# Altium project bop_it.PrjPcb
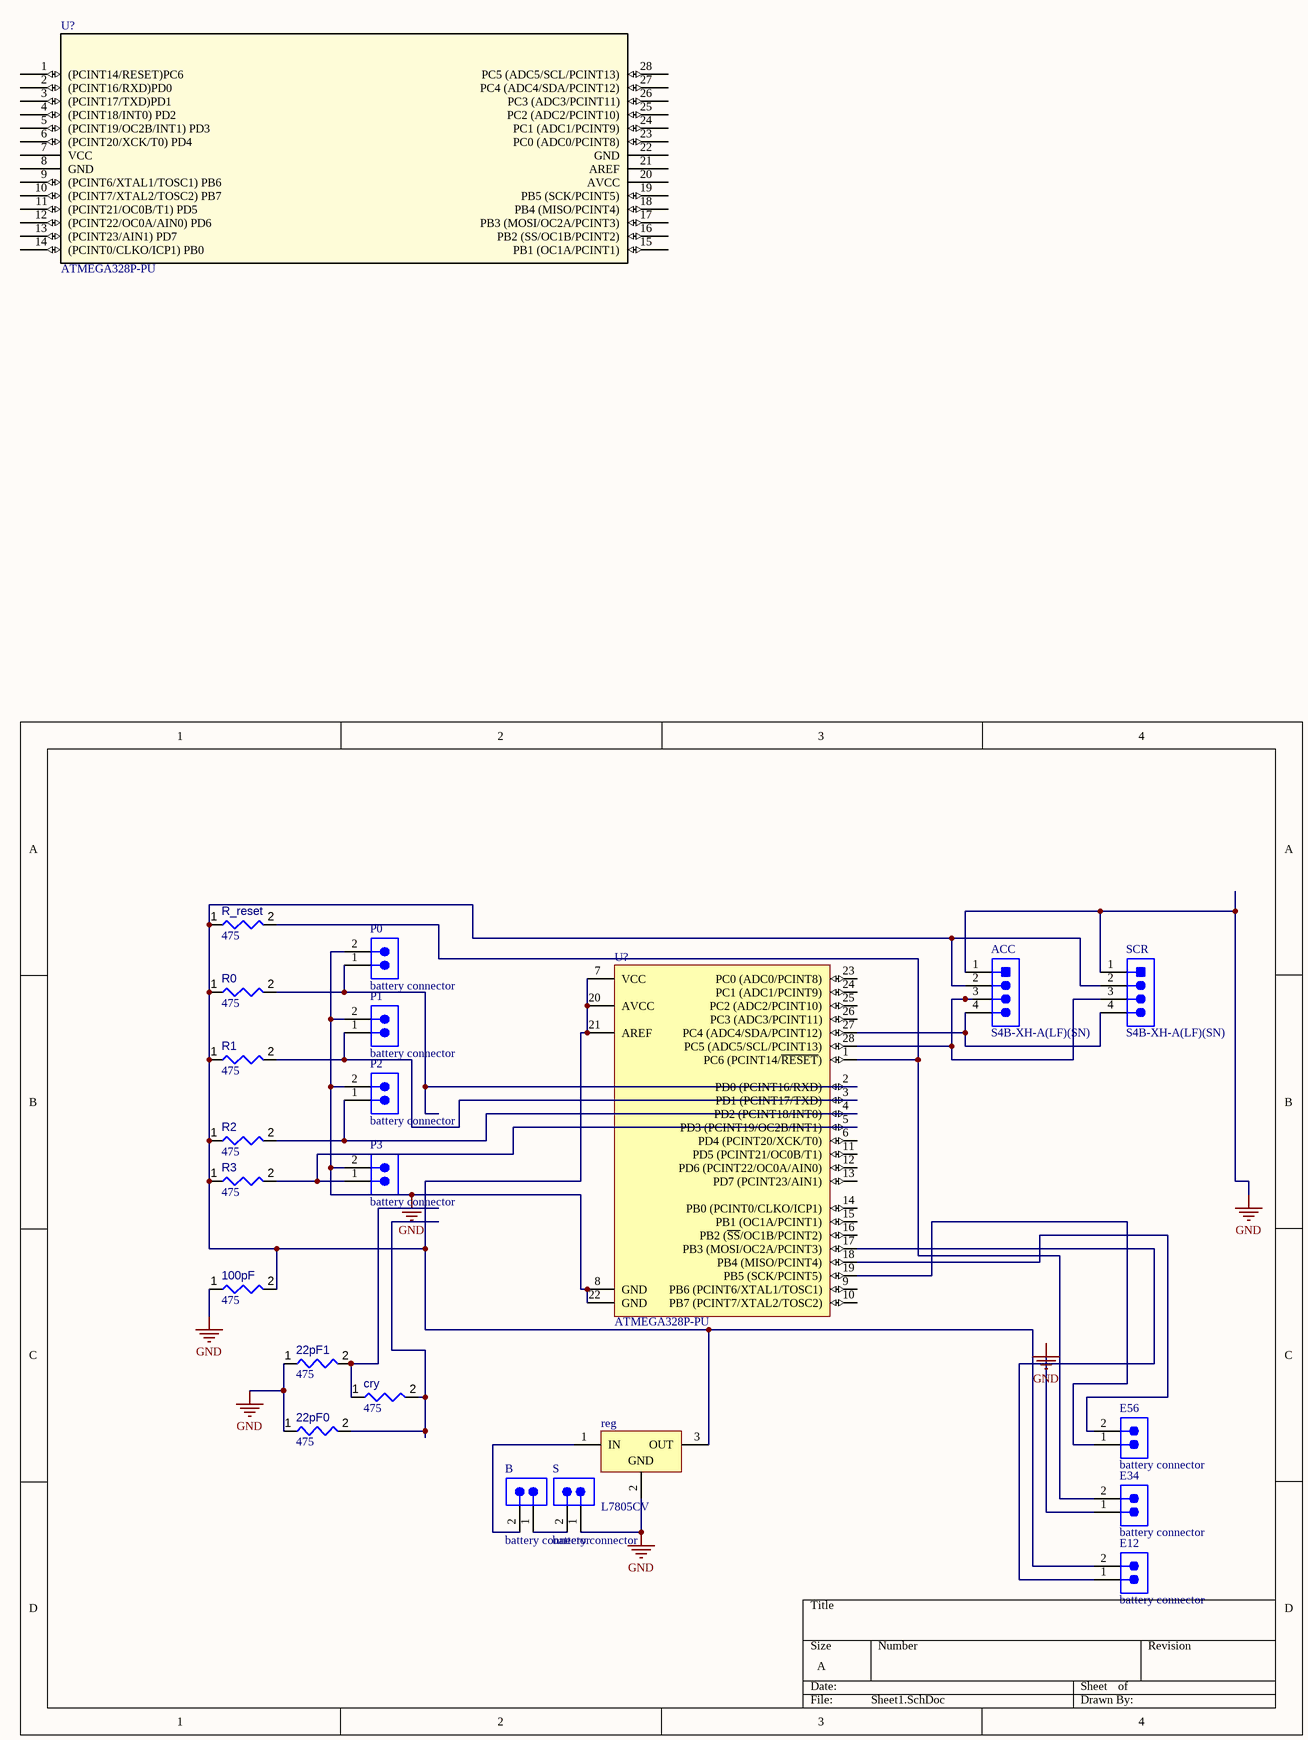
[diagram p0: Sheet1.SchDoc]
1 sheet, 23 parts. Net scope: global (net labels, ports and power ports of the same name join across sheets).
Board file: PCB1.PcbDoc

## Sheet Sheet1.SchDoc
size A; SheetNumber: 1; SheetTotal: 1

### Parts
22pF0  value 475  [RESA60-630X240]  (hidden comment: MFR-25FBF52-475R)
22pF1  value 475  [RESA60-630X240]  (hidden comment: MFR-25FBF52-475R)
100pF  value 475  [RESA60-630X240]  (hidden comment: MFR-25FBF52-475R)
ACC  S4B-XH-A(LF)(SN)  [JST-S4B-XH-A(LF)(SN)_V]
B  battery connector  [SMTC-TSW-102-26-XX-S]
cry  value 475  [RESA60-630X240]  (hidden comment: MFR-25FBF52-475R)
E12  battery connector  [SMTC-TSW-102-26-XX-S]
E34  battery connector  [SMTC-TSW-102-26-XX-S]
E56  battery connector  [SMTC-TSW-102-26-XX-S]
MEGA  ATMEGA328P-PU  [ATML-28P3]
P0  battery connector  [SMTC-TSW-102-26-XX-S]
P1  battery connector  [SMTC-TSW-102-26-XX-S]
P2  battery connector  [SMTC-TSW-102-26-XX-S]
P3  battery connector  [SMTC-TSW-102-26-XX-S]
R0  value 475  [RESA60-630X240]  (hidden comment: MFR-25FBF52-475R)
R1  value 475  [RESA60-630X240]  (hidden comment: MFR-25FBF52-475R)
R2  value 475  [RESA60-630X240]  (hidden comment: MFR-25FBF52-475R)
R3  value 475  [RESA60-630X240]  (hidden comment: MFR-25FBF52-475R)
R_reset  value 475  [RESA60-630X240]  (hidden comment: MFR-25FBF52-475R)
reg  L7805CV  [TO220]
S  battery connector  [SMTC-TSW-102-26-XX-S]
SCR  S4B-XH-A(LF)(SN)  [JST-S4B-XH-A(LF)(SN)_V]
U?  ATMEGA328P-PU  [28P3_ATM]

### Nets
GND: 22pF0.1 22pF1.1 100pF.1 ACC.1 E34.1 MEGA.8(GND) MEGA.22(GND) P0.2 P1.2 P2.2 P3.2 reg.2(GND) S.1 SCR.1
Net22pF0_2: 22pF0.2 cry.2
Net22pF1_2: 22pF1.2 cry.1
Net100pF_2: 100pF.2 ACC.2 E12.2 MEGA.7(VCC) MEGA.20(AVCC) MEGA.21(AREF) R0.1 R1.1 R2.1 R3.1 R_reset.1 reg.3(OUT) SCR.2
NetACC_3: ACC.3 MEGA.28(PC5_(ADC5/SCL/PCINT13)) SCR.3
NetACC_4: ACC.4 MEGA.27(PC4_(ADC4/SDA/PCINT12)) SCR.4
NetB_1: B.1 S.2
NetB_2: B.2 reg.1(IN)
NetE12_1: E12.1 MEGA.17(PB3_(MOSI/OC2A/PCINT3))
NetE34_2: E34.2 MEGA.1(PC6_(PCINT14/~{RESET})) R_reset.2
NetE56_1: E56.1 MEGA.19(PB5_(SCK/PCINT5))
NetE56_2: E56.2 MEGA.18(PB4_(MISO/PCINT4))
NetMEGA_2: MEGA.2(PD0_(PCINT16/RXD)) P0.1 R0.2
NetMEGA_3: MEGA.3(PD1_(PCINT17/TXD)) P1.1 R1.2
NetMEGA_4: MEGA.4(PD2_(PCINT18/INT0)) P2.1 R2.2
NetMEGA_5: MEGA.5(PD3_(PCINT19/OC2B/INT1)) P3.1 R3.2

Not connected (* = marked no-connect by the designer): MEGA 6(PD4_(PCINT20/XCK/T0)) 9(PB6_(PCINT6/XTAL1/TOSC1)) 10(PB7_(PCINT7/XTAL2/TOSC2)) 11(PD5_(PCINT21/OC0B/T1)) 12(PD6_(PCINT22/OC0A/AIN0)) 13(PD7_(PCINT23/AIN1)) 14(PB0_(PCINT0/CLKO/ICP1)) 15(PB1_(OC1A/PCINT1)) 16(PB2_(~{SS}/OC1B/PCINT2)) 23(PC0_(ADC0/PCINT8)) 24(PC1_(ADC1/PCINT9)) 25(PC2_(ADC2/PCINT10)) 26(PC3_(ADC3/PCINT11)); U? 1((PCINT14/RESET)PC6) 2((PCINT16/RXD)PD0) 3((PCINT17/TXD)PD1) 4((PCINT18/INT0)_PD2) 5((PCINT19/OC2B/INT1)_PD3) 6((PCINT20/XCK/T0)_PD4) 7(VCC) 8(GND) 9((PCINT6/XTAL1/TOSC1)_PB6) 10((PCINT7/XTAL2/TOSC2)_PB7) 11((PCINT21/OC0B/T1)_PD5) 12((PCINT22/OC0A/AIN0)_PD6) 13((PCINT23/AIN1)_PD7) 14((PCINT0/CLKO/ICP1)_PB0) 15(PB1_(OC1A/PCINT1)) 16(PB2_(SS/OC1B/PCINT2)) 17(PB3_(MOSI/OC2A/PCINT3)) 18(PB4_(MISO/PCINT4)) 19(PB5_(SCK/PCINT5)) 20(AVCC) 21(AREF) 22(GND) 23(PC0_(ADC0/PCINT8)) 24(PC1_(ADC1/PCINT9)) 25(PC2_(ADC2/PCINT10)) 26(PC3_(ADC3/PCINT11)) 27(PC4_(ADC4/SDA/PCINT12)) 28(PC5_(ADC5/SCL/PCINT13))

### Library data of the parts
22pF0 22pF1 100pF cry R0-R3 R_reset = CMP-009-00056-3: Axial Resistor, 475 Ohm, +/- 1%, 0.25 W, -55 to 155 degC, 2-Pin THD, RoHS, Bulk; Manufacturer: Yageo; Voltage Rating: 250V; Power: 250mW; Max Operating Temperature: 155°C; Datasheet Version: Apr-13; Packaging: Bulk; Case/Package: Axial; Datasheet URL: http://www.yageo.com/documents/recent/Yageo%20LR_MFR_2013.pdf; Min Operating Temperature: -55°C; Manufacturer URL: http://www.yageo.com/; Tolerance: 1%; Package Reference: MFR-25; Package Description: 2-Pin Axial Lead, Dia 2.4 mm, Body Length 6.3 mm; RoHS Compliant: True; Mounting Technology: TH; Package Quantity: 200
ACC SCR = CMP-002-00034-1: Male Header, Pitch 2.5 mm, 1 x 4 Position, Height 6.1 mm, Tail Length 3.4 mm, -25 to 85 degC, RoHS, Bulk; Manufacturer: JST; RoHS Compliant: Unknown; Manufacturer URL: http://www.jst.com/home2.html; Connector Type: Header; Datasheet URL: http://www.jst-mfg.com/product/pdf/eng/eXH.pdf; Gender: Male; Package Reference: S4B-XH-A(LF)(SN); Datasheet Version: May-16; Case/Package: S4B-XH-A(LF)(SN); Mounting Technology: TH; Max Operating Temperature: 85°C; Min Operating Temperature: -25°C; Package Description: XH Series Disconnectable Crimp Style Connector, Pitch 2.5 mm, 1 x 4 Position, Height 6.1 mm, Tail Length 3.4 mm
B E12 E34 E56 P0-P3 S = CMP-002-00089-1: Headers & Wire Housings Classic PCB Header Strips, 0.100 pitch; Gender: Male; Contact Post Length: 3.2mm; Number of Positions: 2; Pitch: 2.54mm; Voltage Rating: 500V; Max Voltage Rating (AC): 550V; Max Current Rating: 7.6A; Number of Rows: 1; Termination: Through Hole; Series: TSW; Contact Mating Length: 5.84mm; Depth: 2.54mm; Contact Gender: Male; REACH SVHC: No SVHC; RoHS Compliant: Yes; Min Operating Temperature: -55°C; Contact Material: Bronze; Housing Color: Black; Housing Material: Polyester; Package Quantity: 1; Max Operating Temperature: 125°C; Orientation: Vertical; Contact Type: -; Radiation Hardening: No; Weight: 0.001257oz; Number of Contacts: 2; Flammability Rating: UL94 V-0; Packaging: Bulk; Contact Plating: Gold; Length: 5.08mm
MEGA = CMP-020-00004-2: 8-Bit Microcontroller with 32 KBytes In-System Programmable Flash, 23 I/Os, -40 to 85 degC, 28-Pin PDIP (28P3), RoHS, Tube; Manufacturer: Atmel; Max Supply Voltage: 5.5V; Density: 32KB; Package Version: Rev. B, 09/2001; Max Clock Frequency: 20MHz; I/Os: 23; Ethernet Channels: 0; Min Supply Voltage: 1.8V; RAM Size: 2KB; Interface: USART
reg = CMP-019-00018-2: Positive Voltage Regulator IC, 1.5 A, 5 V, 0 to 125 degC, 3-Pin TO-220, RoHS, Tube; Manufacturer: STMicroelectronics; Dropout Voltage: 2V; Outputs: 1; Min Input Voltage: 7V; Output Current: 1.5A; Nominal Output Voltage: 5V; Max Supply Voltage: 20V; Min Supply Voltage: 8V; Max Input Voltage: 35V; Manufacturer URL: http://www.st.com/; Datasheet Version: Rev 30, 09/2012; Min Operating Temperature: 0°C; Pins: 3; Max Operating Temperature: 125°C; RoHS Compliant: True; Output Voltage: 5V; Mounting Technology: TH; Package Quantity: 50; Datasheet URL: https://datasheet.ciiva.com/15111/getdatasheetpartid-44136-15111027.pdf; Case/Package: TO-220; Packaging: Rail/Tube; Max Ouput Current: 1.5A
U? = ATMEGA328P-PU: No Description Available; Mfr_Name: Microchip